# Altium schematic sheet interface.SchDoc
size 209 x 297 mm
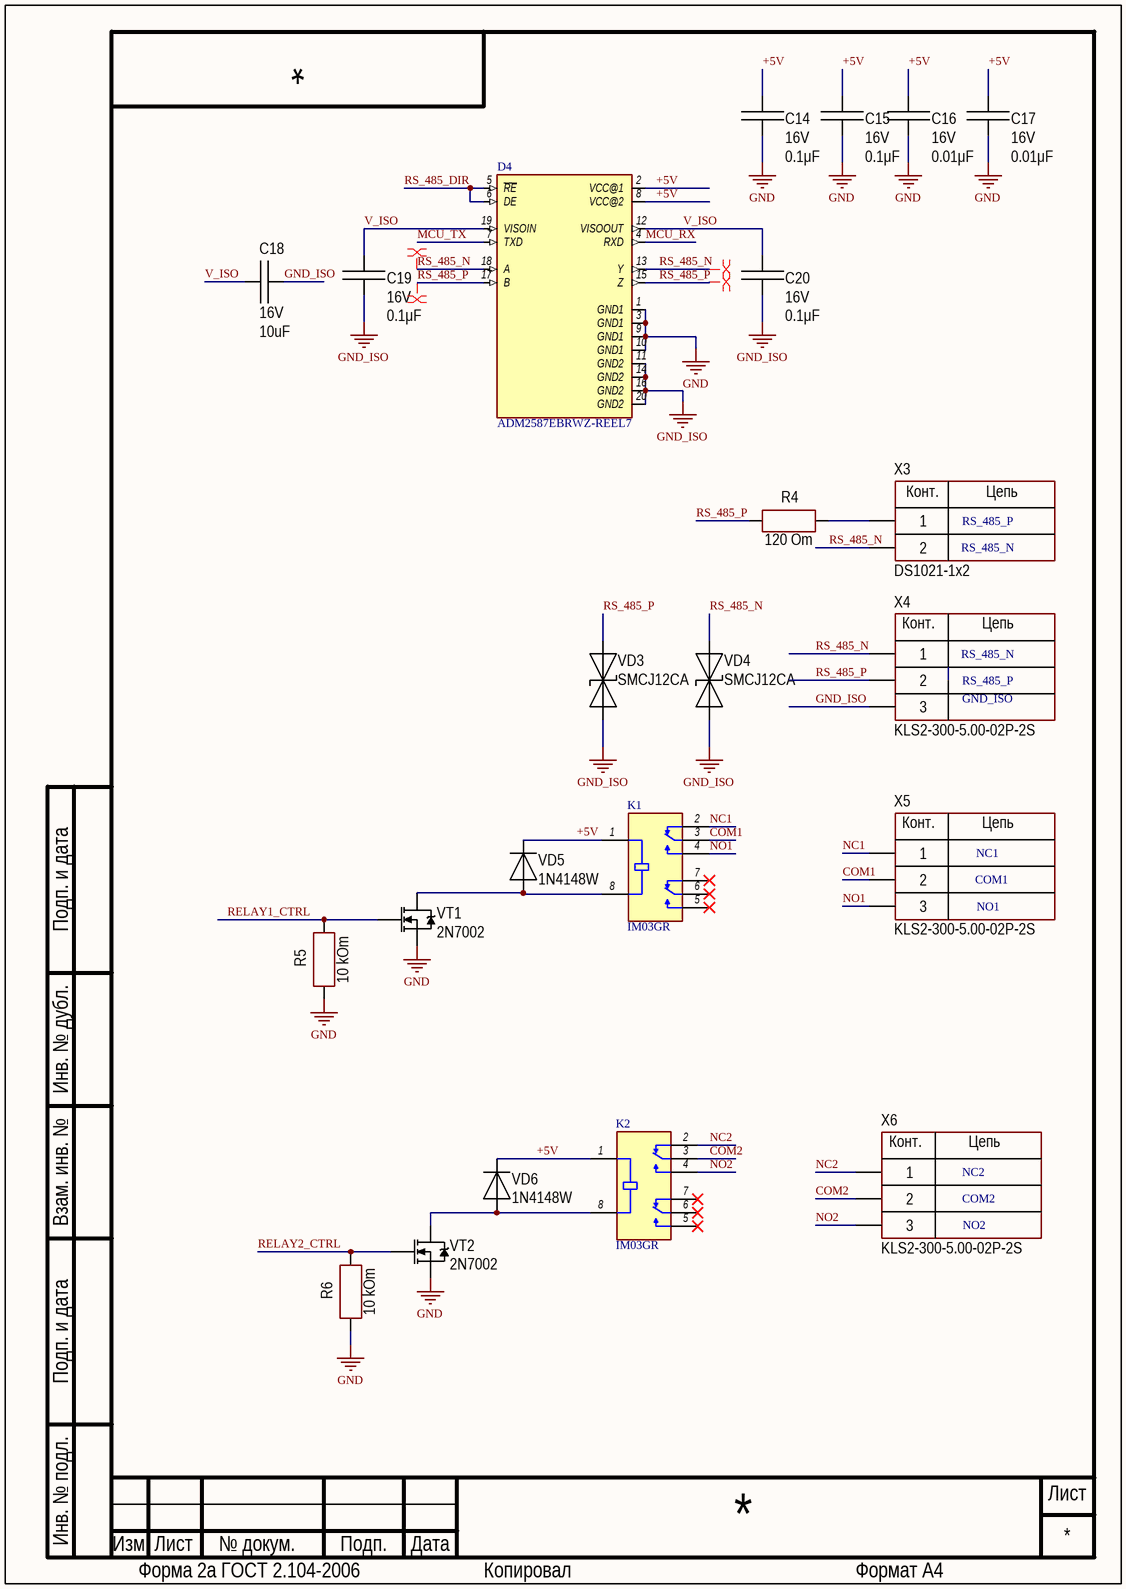
[diagram p0: interface.SchDoc]

## Parts
C14  value 0.1μF  Voltage: 16V  [CAP: 0603]
C15  value 0.1μF  Voltage: 16V  [CAP: 0603]
C16  value 0.01μF  Voltage: 16V  [CAP: 0603]
C17  value 0.01μF  Voltage: 16V  [CAP: 0603]
C18  value 10uF  Voltage: 16V  [CAP: 0603]
C19  value 0.1μF  Voltage: 16V  [CAP: 0603]
C20  value 0.1μF  Voltage: 16V  [CAP: 0603]
D4  ADM2587EBRWZ-REEL7  [SOIC127P1032X265-20N]
K1  IM03GR  [RELAY_IM03GR]
K2  IM03GR  [RELAY_IM03GR]
R4  120 Om  [CH0603R]
R5  10 kOm  [CH0603R]
R6  10 kOm  [CH0603R]
VD3  SMCJ12CA  [SMC]
VD4  SMCJ12CA  [SMC]
VD5  1N4148W  [SOD123]
VD6  1N4148W  [SOD123]
VT1  2N7002  [SOT23_132]
VT2  2N7002  [SOT23_132]
X3  CommentText: DS1021-1x2  [CON: PLS-2]
X4  KLS2-300-5.00-02P-2S  [CON: 300-03P-5.0]
X5  KLS2-300-5.00-02P-2S  [CON: 300-03P-5.0]
X6  KLS2-300-5.00-02P-2S  [CON: 300-03P-5.0]

## Nets
GND: C14.1 C15.1 C16.1 C17.1 D4.1(GND1) D4.3(GND1) D4.9(GND1) D4.10(GND1) R5.1 R6.1 VT1.3(S) VT2.3(S)
GND_ISO: C18.1 C19.1 C20.1 D4.11(GND2) D4.14(GND2) D4.16(GND2) D4.20(GND2) VD3.2(C) VD4.2(C) X4.3
+5V: C14.2 C15.2 C16.2 C17.2 D4.2(VCC@1) D4.8(VCC@2) K1.1(COIL1) K2.1(COIL1) VD5.2 VD6.2
COM1: K1.3(COM1) X5.2
COM2: K2.3(COM1) X6.2
MCU_RX: D4.4(RXD)
MCU_TX: D4.7(TXD)
NC1: K1.2(NC1) X5.1
NC2: K2.2(NC1) X6.1
NO1: K1.4(NO1) X5.3
NO2: K2.4(NO1) X6.3
RELAY1_CTRL: R5.2 VT1.1(G)
RELAY2_CTRL: R6.2 VT2.1(G)
RS_485_DIR: D4.5(~{RE}) D4.6(DE)
RS_485_N: D4.13(Y) D4.18(A) VD4.1(A) X3.2 X4.1
RS_485_P: D4.15(Z) D4.17(B) R4.1 VD3.1(A) X4.2
V_ISO: C18.2 C19.2 C20.2 D4.12(VISOOUT) D4.19(VISOIN)
NetK1_8: K1.8(COIL2) VD5.1 VT1.2(D)
NetK2_8: K2.8(COIL2) VD6.1 VT2.2(D)
NetR4_2: R4.2 X3.1

Not connected (* = marked no-connect by the designer): K1 5(NO2)* 6(COM2)* 7(NC2)*; K2 5(NO2)* 6(COM2)* 7(NC2)*

## Layout directives
differential pair: RS_485_N, RS_485_P

## Notes on the sheet
- RS_485_P
- RS_485_N
- GND_ISO
- NC1
- COM1
- NO1
- COM2
- NC2
- NO2
- Подп. и дата
- Инв. № дубл.
- Взам. инв. №
- Инв. № подл.
- Изм.
- Лист
- № докум.
- Подп.
- Дата
- Форма 2а ГОСТ 2.104-2006
- Копировал
- Формат А4
- (in symbol 3-Connector) Конт.; Цепь
- (in symbol PLS-2) Конт.; Цепь

## Library data of the parts
C14 C15 C19 C20 = Ceramic_0603: Manufacturer: Yageo; PartNumber: CC0603KRX7R7BB104; ValueManufacturerPartNumber: Ceramic capacitor, 0.1μF, X7R, ±10%, 16V, 0603, -55...+125°C; TypeCapacitor: Ceramic capacitor; Tolerance: ±10%; TypeDielectric: X7R; Package: 0603; HelpURL: https://www.digikey.com/product-detail/en/yageo/CC0603KRX7R7BB104/311-1088-1-ND/302998; Temperature: -55...+125°C
C16 C17 = Ceramic_0603: Manufacturer: Yageo; PartNumber: CC0603KRX7R7BB104; ValueManufacturerPartNumber: Ceramic capacitor, 0.01μF, X7R, ±10%, 16V, 0603, -55...+125°C; TypeCapacitor: Ceramic capacitor; Tolerance: ±10%; TypeDielectric: X7R; Package: 0603; HelpURL: https://www.digikey.com/product-detail/en/yageo/CC0603KRX7R7BB104/311-1088-1-ND/302998; Temperature: -55...+125°C
C18 = Ceramic_0603: Manufacturer: Yageo; PartNumber: CC0603KRX7R7BB104; ValueManufacturerPartNumber: Ceramic capacitor, 10uF, X7R, ±10%, 16V, 0603, -55...+125°C; TypeCapacitor: Ceramic capacitor; Tolerance: ±10%; TypeDielectric: X7R; Package: 0603; HelpURL: https://www.digikey.com/product-detail/en/yageo/CC0603KRX7R7BB104/311-1088-1-ND/302998; Temperature: -55...+125°C
D4 = ADM2587EBRWZ-REEL7: 2.5 kV Signal and Power Isolated, Â±15 kV ESD Protected, Full/Half Duplex RS-485 Transceiver (500kbps); MF: Analog Devices; SnapEDA_Link: https://www.snapeda.com/parts/ADM2587EBRWZ-REEL7/Analog+Devices/view-part/?ref=snap; Package: SOIC -20 Analog Devices; Value: *; MP: ADM2587EBRWZ-REEL7; Check_prices: https://www.snapeda.com/parts/ADM2587EBRWZ-REEL7/Analog+Devices/view-part/?ref=eda
K1 K2 = IM03GR: Signal Relay 5VDC 2A DPDT( (10mm 7.5mm 5.65mm)) SMD Medical; MF: TE Connectivity; SnapEDA_Link: https://www.snapeda.com/parts/IM03GR/TE+Connectivity/view-part/?ref=snap; Package: None; Value: *; MP: IM03GR; Check_prices: https://www.snapeda.com/parts/IM03GR/TE+Connectivity/view-part/?ref=eda
R4-R6 = Resistor: Manufacturer: *; Model: *; HelpURL: *; ComponentKind: *; Value: *
VD3 VD4 = TVS-diod: ComponentKind: *; Manufacturer: *; Model: *; HelpURL: *
VD5 VD6 = Diod: ComponentKind: *; Manufacturer: *; Model: *; HelpURL: *
VT1 VT2 = N-chanel: Mosfet; Model: *; Manufacturer: *; ComponentKind: *; HelpURL: *
X3 = PLS-2: Manufacturer: Connfly; ValueManufacturerPartNumber: Connector, 2pin, 2.54mm, 500VAC, 3A; TypeConnector: Connector; VoltageMax: 500VAC; Pitch: 2.54mm; CurrentMax: 3A; Multichannel: 2pin; HelpURL: https://www.chipdip.ru/product/pls-2; PartNumber: PLS-2
X4-X6 = 3-Connector: Model: *; Manufacturer: *; HelpURL: *; ComponentKind: *